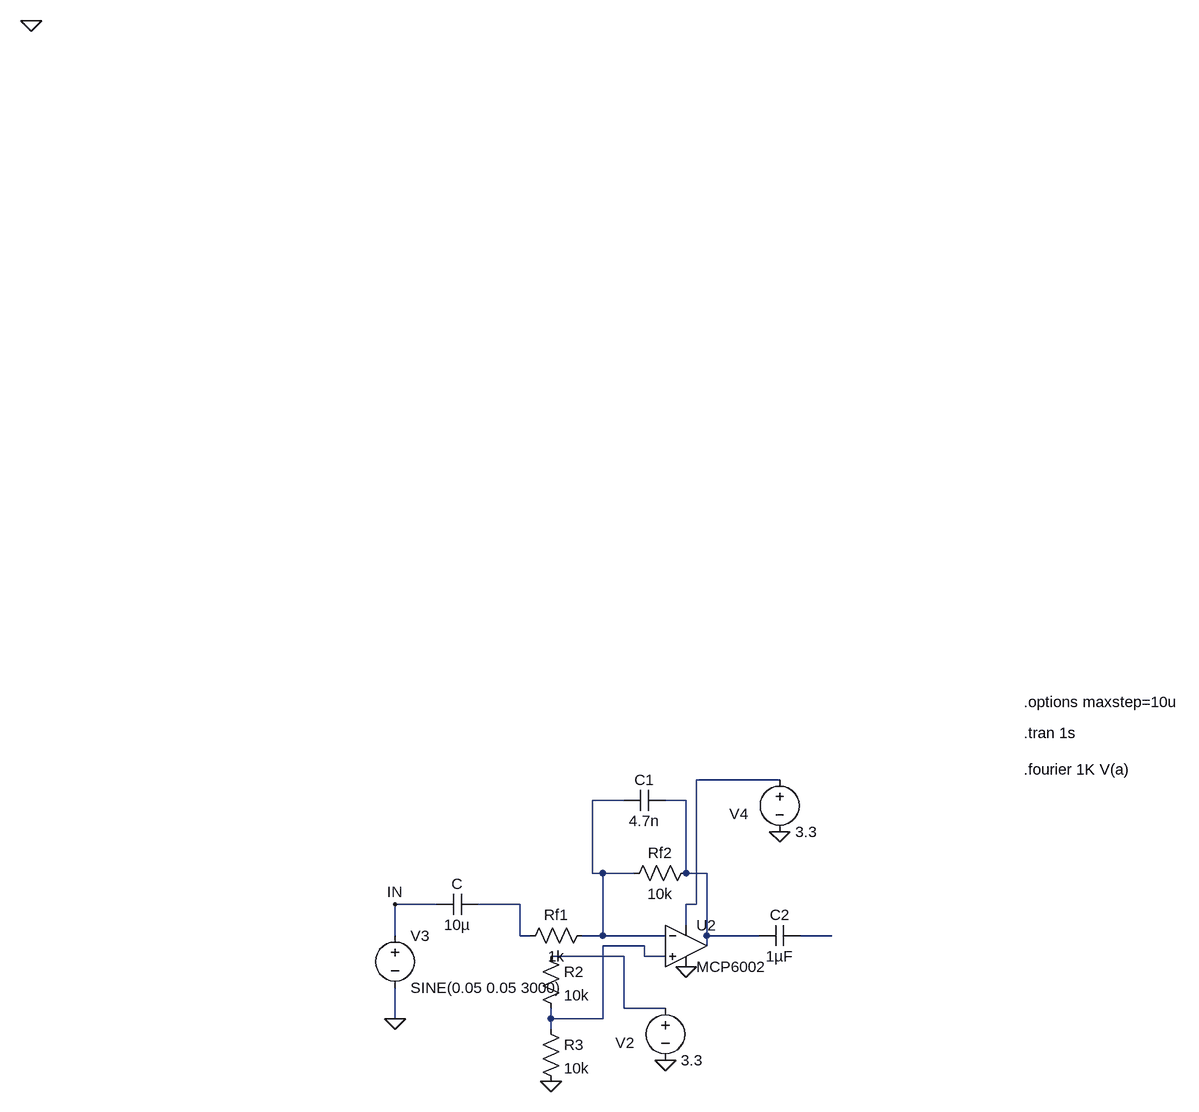
[diagram p0: schematic audioamp.asc]
audioamp.asc, the LTspice schematic file:
Version 4
SHEET 1 2344 2032
WIRE 1152 1168 1024 1168
WIRE 912 1200 864 1200
WIRE 1008 1200 976 1200
WIRE 864 1312 864 1200
WIRE 880 1312 864 1312
WIRE 928 1312 880 1312
WIRE 1008 1312 1008 1200
WIRE 1040 1312 1008 1312
WIRE 624 1360 560 1360
WIRE 752 1360 688 1360
WIRE 1024 1360 1024 1168
WIRE 1024 1360 1008 1360
WIRE 1008 1392 1008 1360
WIRE 560 1408 560 1360
WIRE 752 1408 752 1360
WIRE 768 1408 752 1408
WIRE 880 1408 880 1312
WIRE 880 1408 848 1408
WIRE 976 1408 880 1408
WIRE 1040 1408 1040 1312
WIRE 1120 1408 1040 1408
WIRE 1232 1408 1184 1408
WIRE 944 1424 880 1424
WIRE 1040 1424 1040 1408
WIRE 912 1440 800 1440
WIRE 944 1440 944 1424
WIRE 976 1440 944 1440
WIRE 912 1520 912 1440
WIRE 976 1520 912 1520
WIRE 560 1536 560 1488
WIRE 800 1536 800 1520
WIRE 880 1536 880 1424
WIRE 880 1536 800 1536
WIRE 800 1552 800 1536
FLAG 800 1632 0
FLAG 560 1536 0
FLAG 560 1360 IN
FLAG 976 1600 0
FLAG 1008 1456 0
FLAG 1152 1248 0
FLAG 0 0 0
SYMBOL voltage 560 1392 R0
WINDOW 123 0 0 Left 0
WINDOW 39 0 0 Left 0
SYMATTR InstName V3
SYMATTR Value SINE(0.05 0.05 3000)
SYMBOL cap 688 1344 R90
WINDOW 0 0 32 VBottom 2
WINDOW 3 32 32 VTop 2
SYMATTR InstName C
SYMATTR Value 10µ
SYMBOL VOLTAGE 976 1504 R0
WINDOW 0 -77 69 Left 2
WINDOW 123 0 0 Left 0
WINDOW 39 0 0 Left 0
SYMATTR InstName V2
SYMATTR Value 3.3
SYMBOL res 784 1424 R0
SYMATTR InstName R2
SYMATTR Value 10k
SYMBOL res 784 1536 R0
SYMATTR InstName R3
SYMATTR Value 10k
SYMBOL res 1024 1296 R90
WINDOW 0 0 56 VBottom 2
WINDOW 3 32 56 VTop 2
SYMATTR InstName Rf2
SYMATTR Value 10k
SYMBOL ZZZ\\OpAmp\\MCP6002 1008 1360 R0
SYMATTR InstName U2
SYMBOL VOLTAGE 1152 1152 R0
WINDOW 0 -77 69 Left 2
WINDOW 123 0 0 Left 0
WINDOW 39 0 0 Left 0
SYMATTR InstName V4
SYMATTR Value 3.3
SYMBOL cap 1184 1392 R90
WINDOW 0 0 32 VBottom 2
WINDOW 3 32 32 VTop 2
SYMATTR InstName C2
SYMATTR Value 1µF
SYMBOL cap 976 1184 R90
WINDOW 0 0 32 VBottom 2
WINDOW 3 32 32 VTop 2
SYMATTR InstName C1
SYMATTR Value 4.7n
SYMBOL res 864 1392 R90
WINDOW 0 0 56 VBottom 2
WINDOW 3 32 56 VTop 2
SYMATTR InstName Rf1
SYMATTR Value 1k
TEXT 1528 1096 Left 2 !.tran 1s
TEXT 1528 1048 Left 2 !.options maxstep=10u
TEXT 1528 1152 Left 2 !.fourier 1K V(a)

The netlist it stands for:
* audioamp.asc
V3 IN 0 SINE(0.05 0.05 3000)
C N004 IN 10µ
V2 N007 0 3.3
R2 N007 N006 10k
R3 N006 0 10k
Rf2 N003 N002 10k
* U2: MCP6002 (symbol ZZZ\OpAmp\MCP6002 not available, pins judged from their places): In+=N006 In-=N002 V+=N001 V-=0 OUT=N003
V4 N001 0 3.3
C2 N005 N003 1µF
C1 N003 N002 4.7n
Rf1 N002 N004 1k
.tran 1s
.options maxstep=10u
.fourier 1K V(a)
.backanno
.end